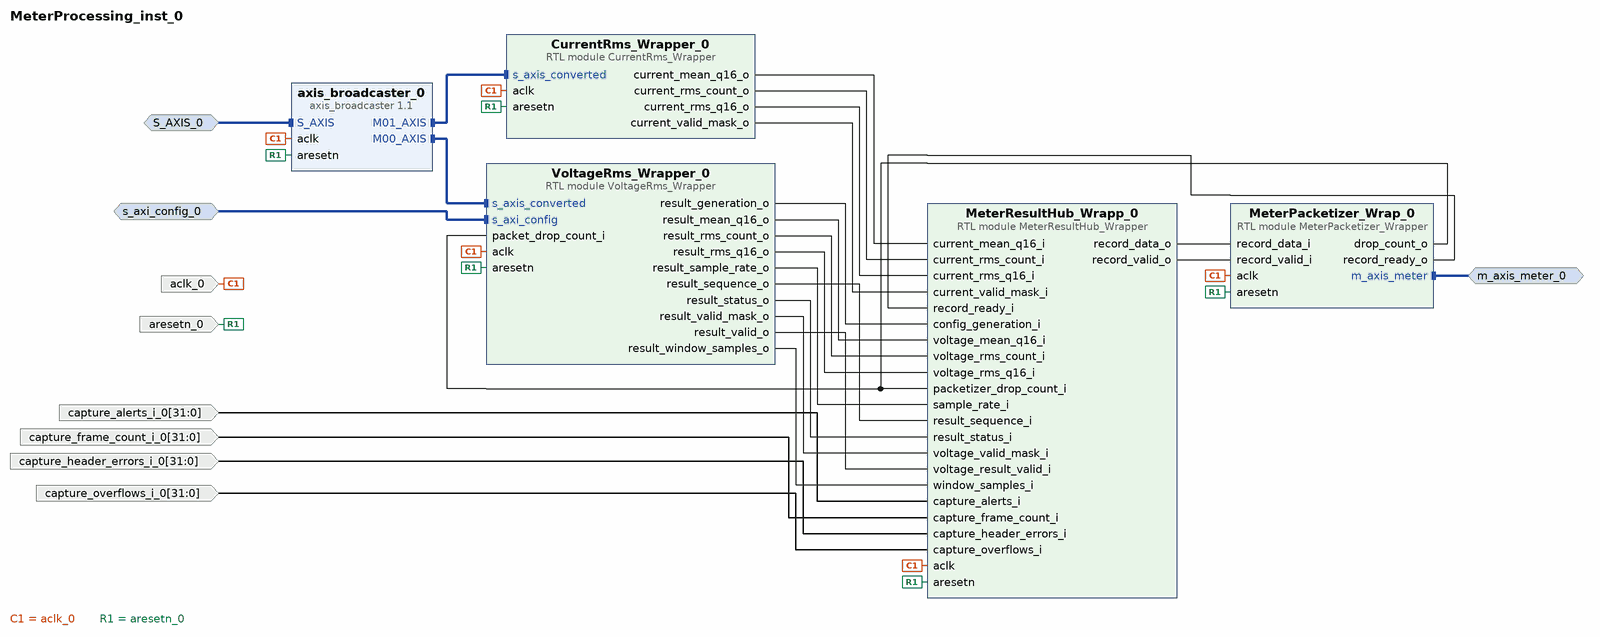
[diagram p0: block diagram of the top level]
# Vivado block design MeterProcessing_inst_0, xck26-sfvc784-2LV-c, Vivado 2025.2
create_bd_design MeterProcessing_inst_0

create_bd_intf_port -mode Slave -vlnv xilinx.com:interface:axis_rtl:1.0 S_AXIS_0
create_bd_intf_port -mode Master -vlnv xilinx.com:interface:axis_rtl:1.0 m_axis_meter_0
create_bd_intf_port -mode Slave -vlnv xilinx.com:interface:aximm_rtl:1.0 s_axi_config_0
create_bd_port -dir I -type rst aresetn_0
create_bd_port -dir I -type clk aclk_0
create_bd_port -dir I -from 31 -to 0 capture_frame_count_i_0
create_bd_port -dir I -from 31 -to 0 capture_header_errors_i_0
create_bd_port -dir I -from 31 -to 0 capture_overflows_i_0
create_bd_port -dir I -from 31 -to 0 capture_alerts_i_0

create_bd_cell -type ip -vlnv xilinx.com:ip:axis_broadcaster:1.1 axis_broadcaster_0
set_property -dict [list \
  CONFIG.HAS_TKEEP 1 \
  CONFIG.HAS_TLAST 1 \
  CONFIG.HAS_TREADY 1 \
  CONFIG.HAS_TSTRB 0 \
  CONFIG.M_TDATA_NUM_BYTES 64 \
  CONFIG.M_TUSER_WIDTH 384 \
  CONFIG.S_TDATA_NUM_BYTES 64 \
  CONFIG.S_TUSER_WIDTH 384 \
  CONFIG.TDEST_WIDTH 0 \
  CONFIG.TID_WIDTH 0 \
] [get_bd_cells axis_broadcaster_0]
create_bd_cell -type module -reference VoltageRms_Wrapper VoltageRms_Wrapper_0
create_bd_cell -type module -reference CurrentRms_Wrapper CurrentRms_Wrapper_0
create_bd_cell -type module -reference MeterResultHub_Wrapper MeterResultHub_Wrapp_0
create_bd_cell -type module -reference MeterPacketizer_Wrapper MeterPacketizer_Wrap_0

# ---- connections ----

connect_bd_intf_net [get_bd_intf_ports m_axis_meter_0] [get_bd_intf_pins MeterPacketizer_Wrap_0/m_axis_meter]
connect_bd_intf_net -intf_net S_AXIS_0_1 [get_bd_intf_ports S_AXIS_0] [get_bd_intf_pins axis_broadcaster_0/S_AXIS]
connect_bd_intf_net [get_bd_intf_pins axis_broadcaster_0/M00_AXIS] [get_bd_intf_pins VoltageRms_Wrapper_0/s_axis_converted]
connect_bd_intf_net [get_bd_intf_pins axis_broadcaster_0/M01_AXIS] [get_bd_intf_pins CurrentRms_Wrapper_0/s_axis_converted]
connect_bd_intf_net -intf_net s_axi_config_0_1 [get_bd_intf_ports s_axi_config_0] [get_bd_intf_pins VoltageRms_Wrapper_0/s_axi_config]
connect_bd_net [get_bd_pins CurrentRms_Wrapper_0/current_mean_q16_o] [get_bd_pins MeterResultHub_Wrapp_0/current_mean_q16_i]
connect_bd_net [get_bd_pins CurrentRms_Wrapper_0/current_rms_count_o] [get_bd_pins MeterResultHub_Wrapp_0/current_rms_count_i]
connect_bd_net [get_bd_pins CurrentRms_Wrapper_0/current_rms_q16_o] [get_bd_pins MeterResultHub_Wrapp_0/current_rms_q16_i]
connect_bd_net [get_bd_pins CurrentRms_Wrapper_0/current_valid_mask_o] [get_bd_pins MeterResultHub_Wrapp_0/current_valid_mask_i]
connect_bd_net [get_bd_pins MeterPacketizer_Wrap_0/drop_count_o] \
  [get_bd_pins VoltageRms_Wrapper_0/packet_drop_count_i] [get_bd_pins MeterResultHub_Wrapp_0/packetizer_drop_count_i]
connect_bd_net [get_bd_pins MeterPacketizer_Wrap_0/record_ready_o] [get_bd_pins MeterResultHub_Wrapp_0/record_ready_i]
connect_bd_net [get_bd_pins MeterResultHub_Wrapp_0/record_data_o] [get_bd_pins MeterPacketizer_Wrap_0/record_data_i]
connect_bd_net [get_bd_pins MeterResultHub_Wrapp_0/record_valid_o] [get_bd_pins MeterPacketizer_Wrap_0/record_valid_i]
connect_bd_net [get_bd_pins VoltageRms_Wrapper_0/result_generation_o] [get_bd_pins MeterResultHub_Wrapp_0/config_generation_i]
connect_bd_net [get_bd_pins VoltageRms_Wrapper_0/result_mean_q16_o] [get_bd_pins MeterResultHub_Wrapp_0/voltage_mean_q16_i]
connect_bd_net [get_bd_pins VoltageRms_Wrapper_0/result_rms_count_o] [get_bd_pins MeterResultHub_Wrapp_0/voltage_rms_count_i]
connect_bd_net [get_bd_pins VoltageRms_Wrapper_0/result_rms_q16_o] [get_bd_pins MeterResultHub_Wrapp_0/voltage_rms_q16_i]
connect_bd_net [get_bd_pins VoltageRms_Wrapper_0/result_sample_rate_o] [get_bd_pins MeterResultHub_Wrapp_0/sample_rate_i]
connect_bd_net [get_bd_pins VoltageRms_Wrapper_0/result_sequence_o] [get_bd_pins MeterResultHub_Wrapp_0/result_sequence_i]
connect_bd_net [get_bd_pins VoltageRms_Wrapper_0/result_status_o] [get_bd_pins MeterResultHub_Wrapp_0/result_status_i]
connect_bd_net [get_bd_pins VoltageRms_Wrapper_0/result_valid_mask_o] [get_bd_pins MeterResultHub_Wrapp_0/voltage_valid_mask_i]
connect_bd_net [get_bd_pins VoltageRms_Wrapper_0/result_valid_o] [get_bd_pins MeterResultHub_Wrapp_0/voltage_result_valid_i]
connect_bd_net [get_bd_pins VoltageRms_Wrapper_0/result_window_samples_o] [get_bd_pins MeterResultHub_Wrapp_0/window_samples_i]
connect_bd_net -net aclk_0_1 [get_bd_ports aclk_0] \
  [get_bd_pins MeterResultHub_Wrapp_0/aclk] [get_bd_pins VoltageRms_Wrapper_0/aclk] [get_bd_pins axis_broadcaster_0/aclk] \
  [get_bd_pins CurrentRms_Wrapper_0/aclk] [get_bd_pins MeterPacketizer_Wrap_0/aclk]
connect_bd_net -net aresetn_0_1 [get_bd_ports aresetn_0] \
  [get_bd_pins MeterResultHub_Wrapp_0/aresetn] [get_bd_pins VoltageRms_Wrapper_0/aresetn] \
  [get_bd_pins axis_broadcaster_0/aresetn] [get_bd_pins CurrentRms_Wrapper_0/aresetn] \
  [get_bd_pins MeterPacketizer_Wrap_0/aresetn]
connect_bd_net -net capture_alerts_i_0_1 [get_bd_ports capture_alerts_i_0] [get_bd_pins MeterResultHub_Wrapp_0/capture_alerts_i]
connect_bd_net -net capture_frame_count_i_0_1 [get_bd_ports capture_frame_count_i_0] [get_bd_pins MeterResultHub_Wrapp_0/capture_frame_count_i]
connect_bd_net -net capture_header_errors_i_0_1 [get_bd_ports capture_header_errors_i_0] [get_bd_pins MeterResultHub_Wrapp_0/capture_header_errors_i]
connect_bd_net -net capture_overflows_i_0_1 [get_bd_ports capture_overflows_i_0] [get_bd_pins MeterResultHub_Wrapp_0/capture_overflows_i]

# ---- address map ----
assign_bd_address -offset 0x00000000 -range 64K -target_address_space [get_bd_addr_spaces s_axi_config_0] [get_bd_addr_segs VoltageRms_Wrapper_0/s_axi_config/reg0]
assign_bd_address -offset 0x00000000 -range 64K -target_address_space [get_bd_addr_spaces s_axi_config_0] [get_bd_addr_segs VoltageRms_Wrapper_0/s_axi_config/reg0]

validate_bd_design
save_bd_design
